# Altium schematic sheet Sheet1.SchDoc
size A4; SheetNumber: 1; SheetTotal: 1
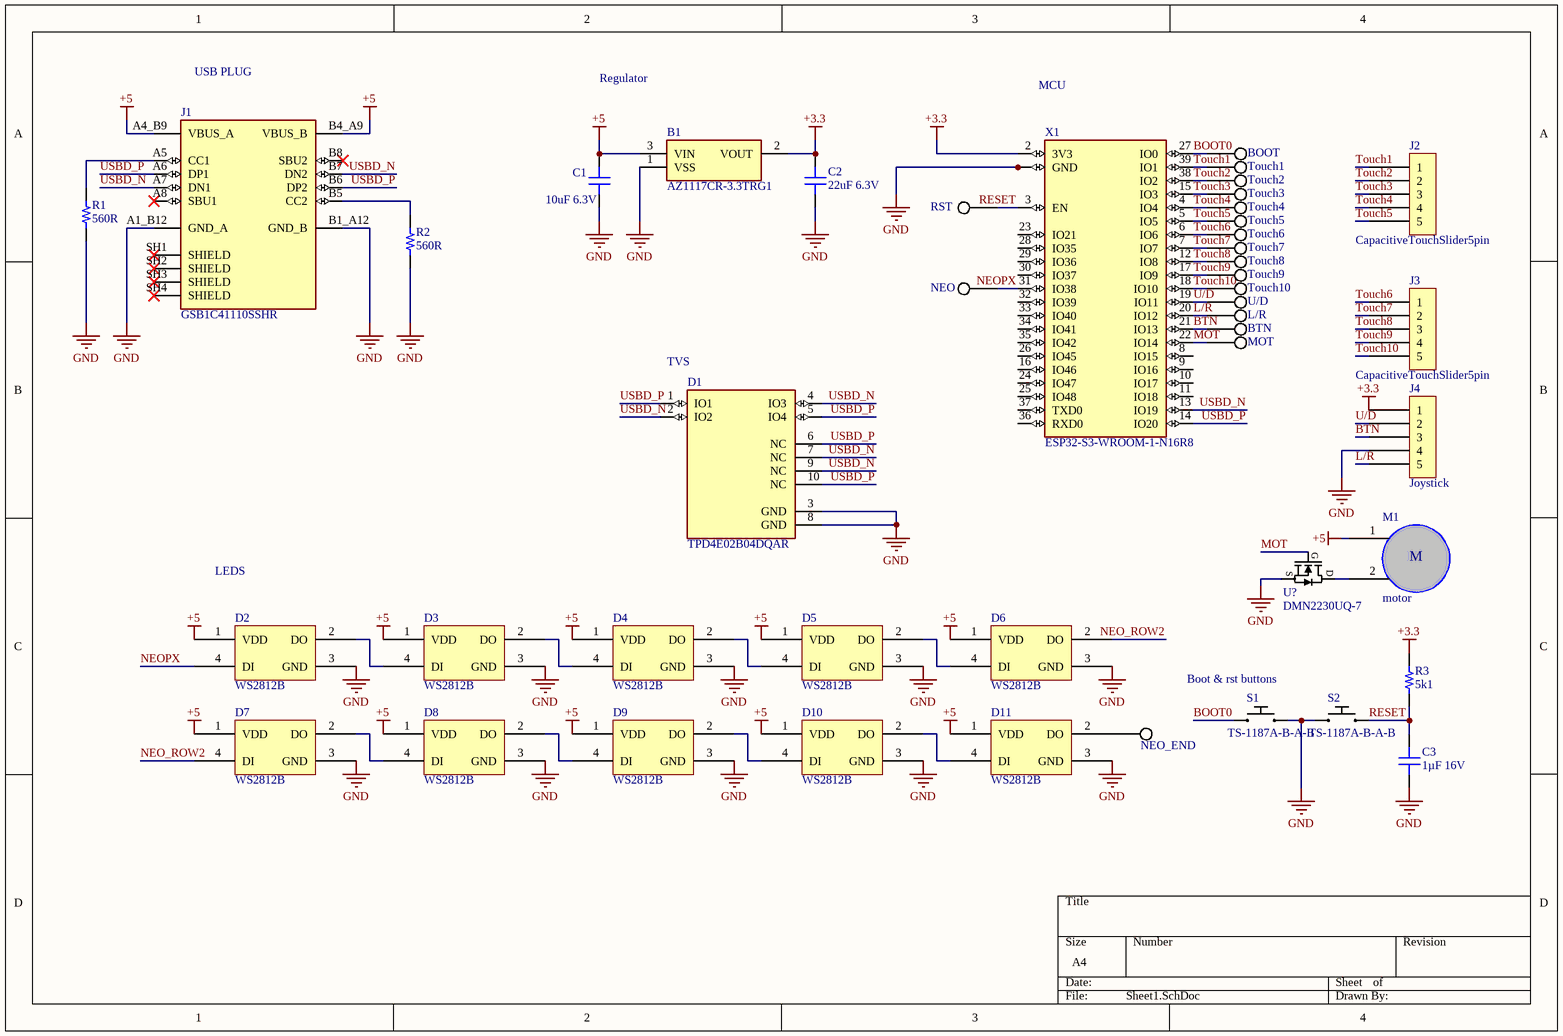
[diagram p0: Sheet1.SchDoc]

## Parts
B1  AZ1117CR-3.3TRG1  [SOT89-3]
BOOT  TestPoint  [TP2020]  (value not drawn)
BTN  TestPoint  [TP2020]  (value not drawn)
C1  10uF 6.3V  [CAP 0603_1608]
C2  22uF 6.3V  [CAP 0603_1608]
C3  1µF 16V  [CAP 0603_1608]
D1  TPD4E02B04DQAR  [DIO_TPD4E02B04DQAR]
D2  WS2812B  [WS2812B5050]
D3  WS2812B  [WS2812B5050]
D4  WS2812B  [WS2812B5050]
D5  WS2812B  [WS2812B5050]
D6  WS2812B  [WS2812B5050]
D7  WS2812B  [WS2812B5050]
D8  WS2812B  [WS2812B5050]
D9  WS2812B  [WS2812B5050]
D10  WS2812B  [WS2812B5050]
D11  WS2812B  [WS2812B5050]
J1  GSB1C41110SSHR  [AMPHENOL_GSB1C41110SSHR]
J2  CapacitiveTouchSlider5pin
J3  CapacitiveTouchSlider5pin
J4  Joystick  [5 pin header]
L/R  TestPoint  [TP2020]  (value not drawn)
M1  motor  [2 pin header]
MOT  TestPoint  [TP2020]  (value not drawn)
NEO  TestPoint  [TP2020]  (value not drawn)
NEO_END  TestPoint  [TP2020]  (value not drawn)
R1  560R  [RES 0603_1608]
R2  560R  [RES 0603_1608]
R3  5k1  [RES 0603_1608]
RST  TestPoint  [TP2020]  (value not drawn)
S1  TS-1187A-B-A-B  [SW_TS-1187A-B-A-B]
S2  TS-1187A-B-A-B  [SW_TS-1187A-B-A-B]
Touch1  TestPoint  [TP2020]  (value not drawn)
Touch2  TestPoint  [TP2020]  (value not drawn)
Touch3  TestPoint  [TP2020]  (value not drawn)
Touch4  TestPoint  [TP2020]  (value not drawn)
Touch5  TestPoint  [TP2020]  (value not drawn)
Touch6  TestPoint  [TP2020]  (value not drawn)
Touch7  TestPoint  [TP2020]  (value not drawn)
Touch8  TestPoint  [TP2020]  (value not drawn)
Touch9  TestPoint  [TP2020]  (value not drawn)
Touch10  TestPoint  [TP2020]  (value not drawn)
U/D  TestPoint  [TP2020]  (value not drawn)
U?  DMN2230UQ-7  [DMN2230UQ_DIO-M]
X1  ESP32-S3-WROOM-1-N16R8  [ESP32S3WROOM1N8R2]

## Nets
+3.3: B1.2(VOUT) C2.2 J4.1 R3.2 X1.2(3V3)
+5: B1.3(VIN) C1.2 D2.1(VDD) D3.1(VDD) D4.1(VDD) D5.1(VDD) D6.1(VDD) D7.1(VDD) D8.1(VDD) D9.1(VDD) D10.1(VDD) D11.1(VDD) J1.A4_B9(VBUS_A) J1.B4_A9(VBUS_B) M1.1
GND: B1.1(VSS) C1.1 C2.1 C3.1 D1.3(GND) D1.8(GND) D2.3(GND) D3.3(GND) D4.3(GND) D5.3(GND) D6.3(GND) D7.3(GND) D8.3(GND) D9.3(GND) D10.3(GND) D11.3(GND) J1.A1_B12(GND_A) J1.B1_A12(GND_B) J4.4 R1.1 R2.1 S1.C(NO) S2.A(COM) U?.3(S) X1.1(GND) X1.40(GND) X1.41(GND) X1.42(GND) X1.43(GND) X1.44(GND) X1.45(GND) X1.46(GND) X1.47(GND) X1.48(GND) X1.49(GND)
BOOT0: BOOT.TP S1.A(COM) X1.27(IO0)
BTN: BTN.TP J4.3 X1.21(IO13)
L/R: J4.5 L/R.TP X1.20(IO12)
MOT: MOT.TP U?.2(G) X1.22(IO14)
NEO_ROW2: D6.2(DO) D7.4(DI)
NEOPX: D2.4(DI) NEO.TP X1.31(IO38)
RESET: C3.2 R3.1 RST.TP S2.C(NO) X1.3(EN)
Touch1: J2.1 Touch1.TP X1.39(IO1)
Touch2: J2.2 Touch2.TP X1.38(IO2)
Touch3: J2.3 Touch3.TP X1.15(IO3)
Touch4: J2.4 Touch4.TP X1.4(IO4)
Touch5: J2.5 Touch5.TP X1.5(IO5)
Touch6: J3.1 Touch6.TP X1.6(IO6)
Touch7: J3.2 Touch7.TP X1.7(IO7)
Touch8: J3.3 Touch8.TP X1.12(IO8)
Touch9: J3.4 Touch9.TP X1.17(IO9)
Touch10: J3.5 Touch10.TP X1.18(IO10)
U/D: J4.2 U/D.TP X1.19(IO11)
USBD_N: D1.2(IO2) D1.4(IO3) D1.7(NC) D1.9(NC) J1.A7(DN1) J1.B7(DN2) X1.13(IO19)
USBD_P: D1.1(IO1) D1.5(IO4) D1.6(NC) D1.10(NC) J1.A6(DP1) J1.B6(DP2) X1.14(IO20)
NetD2_2: D2.2(DO) D3.4(DI)
NetD3_2: D3.2(DO) D4.4(DI)
NetD4_2: D4.2(DO) D5.4(DI)
NetD5_2: D5.2(DO) D6.4(DI)
NetD7_2: D7.2(DO) D8.4(DI)
NetD8_2: D8.2(DO) D9.4(DI)
NetD9_2: D9.2(DO) D10.4(DI)
NetD10_2: D10.2(DO) D11.4(DI)
NetD11_2: D11.2(DO) NEO_END.TP
NetJ1_A5: J1.A5(CC1) R1.2
NetJ1_B5: J1.B5(CC2) R2.2
NetM1_2: M1.2 U?.1(D)

Not connected (* = marked no-connect by the designer): J1 A8(SBU1)* B8(SBU2)* SH1(SHIELD)* SH2(SHIELD)* SH3(SHIELD)* SH4(SHIELD)*; X1 8(IO15) 9(IO16) 10(IO17) 11(IO18) 16(IO46) 23(IO21) 24(IO47) 25(IO48) 26(IO45) 28(IO35) 29(IO36) 30(IO37) 32(IO39) 33(IO40) 34(IO41) 35(IO42) 36(RXD0) 37(TXD0)

## Notes on the sheet
- USB PLUG
- Regulator
- MCU
- (near D1) TVS
- LEDS
- Boot & rst buttons
- (in symbol VibrationMotor) M

## Library data of the parts
B1 = TRS-RTZP45: 3.3v LDO Voltage regulator; Manufacturer_Name: Torex; Manufacturer_Part_Number: XC6206P331MR-G; Geometry.Height: 1.3mm; SCH_Comment: AZ1117CR33; Mouser Part Number: 865-XC6206P331MR-G; Mouser Price/Stock: https://www.mouser.co.uk/ProductDetail/Torex-Semiconductor/XC6206P331MR-G?qs=AsjdqWjXhJ%252B7jjWBpr1yow%3D%3D; Datasheet Link: https://www.torexsemi.com/file/xc6206/XC6206.pdf; Part Number: TRS-RTZP45; Supplier 1: Digi-key; JLC PartNumber: C460428; Supplier Part Number 1: AZ1117CR-3.3TRG1DICT-ND
BOOT BTN L/R MOT NEO NEO_END RST Touch1-Touch10 U/D = JMP-RTZL7I: PC TEST POINT MINIATURE; Manufacturer: Keystone Electronics; SCH_Comment: 5015 TestPoint; Part Number: JMP-RTZL7I; Supplier 1: DigiKey; Supplier Part Number 1: 36-5015TR-ND
C1 = CAP0603-RU10OA: CAP CER 10uF; Manufacturer: YAGEO; Tolerance: ±10%; Part Number: CAP0603-RU10OA; SCH_Comment: 10uF 6.3V; Value: 10uF; Rated Voltage: 6.3V; Supplier 1: Digi-Key; Supplier Part Number 1: 311-1781-1-ND; JLC PartNumber: C19702; Size: 0603 (1608 Metric)
C2 = CAP0603-SAQ85G: 6.3V 22uF X5R ±20% 0603 Multilayer Ceramic Capacitors MLCC - SMD/SMT ROHS; Manufacturer: Samsung Electro-Mechanics; Part Number: CAP0603-SAQ85G; SCH_Comment: 22uF 6.3V; Value: 22uF; Tolerance: ±20%; Rated Voltage: 6.3V; Supplier 1: Digi-Key; JLC PartNumber: C59461
C3 = CAP-RTZP4D: CAP CER 1UF 16V X7R 0603; Manufacturer: YAGEO; Tolerance: ±10%; Part Number: CAP-RTZP4D; SCH_Comment: 1µF 16V; Value: 1µF; Rated Voltage: 16V; Supplier 1: Digi-key; Supplier Part Number 1: 311-1446-1-ND; JLC PartNumber: C15849; Size: 0603 (1608 Metric)
D1 = DIO-RTZP4I: ESD protection diode; MF: Texas Instruments; Value: *; MP: TPD4E02B04DQAR; Package: USON-10 Texas Instruments; Purchase-URL: https://pricing.snapeda.com/search/part/TPD4E02B04DQAR/?ref=eda; SnapEDA_Link: https://www.snapeda.com/parts/TPD4E02B04DQAR/Texas%20Instruments/view-part/576424/?ref=snap; Check_prices: https://www.snapeda.com/parts/TPD4E02B04DQAR/Texas%20Instruments/view-part/576424/?ref=eda; Digi-Key_Part_Number: 296-43875-1-ND; Part Number: DIO-RTZP4I; SCH_Comment: TPD4E02B04; Supplier 1: Digikey; Supplier Part Number 1: 296-43875-2-ND
D2-D11 = LED-RTZP4R: NEOPIXEL RGB LED; Manufacturer: Worldsemi; Part Number: LED-RTZP4R; SCH_Comment: WS2812B; JLC PartNumber: C2843785
J1 = USB_16p_SMT: 16 pin usb type c right angle female connector; Manufacturer: Amphenol; MF: Amphenol Canada; SCH_Comment: USB-C; SnapEDA_Link: https://www.snapeda.com/parts/GSB1C41110SSHR/Amphenol/view-part/?ref=snap; Package: None; Value: *; MP: GSB1C41110SSHR; Check_prices: https://www.snapeda.com/parts/GSB1C41110SSHR/Amphenol/view-part/?ref=eda; Part Number: USB_16p_SMT
J2 J3 = CapacitiveTouchSlider5pin: A 5 pad capacitive touch slider; Manufacturer: no; Part Number: CapacitiveTouchSlider5pin; SCH_Comment: CapacitiveTouchSlider5pin
J4 = 5PinHeader: 5 pin header; Part Number: 5PinHeader; SCH_Comment: 5 pin header; Supplier 1: N/A
M1 = VibrationMotor: Vibrating motor; Manufacturer: ChingChong; SCH_Comment: Vibrator; Part Number: VibrationMotor
R1 R2 = RES-RTZP5N: RES SMD 560 OHM 1% 1/10W 0603; Manufacturer: Panasonic Electronic Components; Value: 560; Power (Watts): 0.1W, 1/10W; Temperature Coefficient: ±100ppm/°C; Part Number: RES-RTZP5N; SCH_Comment: 560R; Tolerance: ±1%; Supplier 1: Digi-key; Supplier Part Number 1: P560HCT-ND; Composition: Thick Film; Features: Automotive AEC-Q200; JLC PartNumber: C23204; Operating Temperature: -55°C ~ 155°C; Size: 0603 (1608 Metric)
R3 = RES-RTZP54: RES SMD 5.1K OHM 1% 1/10W 0603; Manufacturer: Panasonic Electronic Components; Power (Watts): 0.1W, 1/10W; Temperature Coefficient: ±100ppm/°C; Part Number: RES-RTZP54; SCH_Comment: 5k1; Value: 5.1k; Tolerance: ±1%; Supplier 1: Digi-key; Supplier Part Number 1: P5.10KHCT-ND; Composition: Thick Film; Features: Automotive AEC-Q200; JLC PartNumber: C23186; Operating Temperature: -55°C ~ 155°C; Size: 0603 (1608 Metric)
S1 S2 = SWT-RY779U: SPST 50mA @ 12VDC Top Actuated Round Button 160gf SMD Tactile Switches RoHS; Manufacturer: XKB Industrial Precision; SCH_Comment: SMT SW; MP: TS-1187A-B-A-B; Value: *; Price: None; Package: None; Availability: Unavailable; Part Number: SWT-RY779U; Supplier 1: DigiKey; Supplier Part Number 1: CKN12221-1-NDS
U? = DMN2230UQ-7: NPN mosfet; Mfr_Name: Diodes Inc; SCH_Comment: Mosfet N; Part Number: DMN2230UQ-7
X1 = ESP32-S3-WROOM-1-N16R8: Bluetooth, WiFi 802.11b/g/n, Bluetooth v5.0 Transceiver Module 2.4GHz PCB Trace Surface Mount; MF: Espressif Systems; SnapEDA_Link: https://www.snapeda.com/parts/ESP32-S3-WROOM-1-N16R8/Espressif+Systems/view-part/?ref=snap; Package: NON STANDARD Espressif Systems; Value: *; MP: ESP32-S3-WROOM-1-N16R8; Check_prices: https://www.snapeda.com/parts/ESP32-S3-WROOM-1-N16R8/Espressif+Systems/view-part/?ref=eda; Part Number: ESP32-S3-WROOM-1-N16R8; SCH_Comment: ESP32-S3